# EAGLE design Si570 USB (EAGLE 7.7.0)
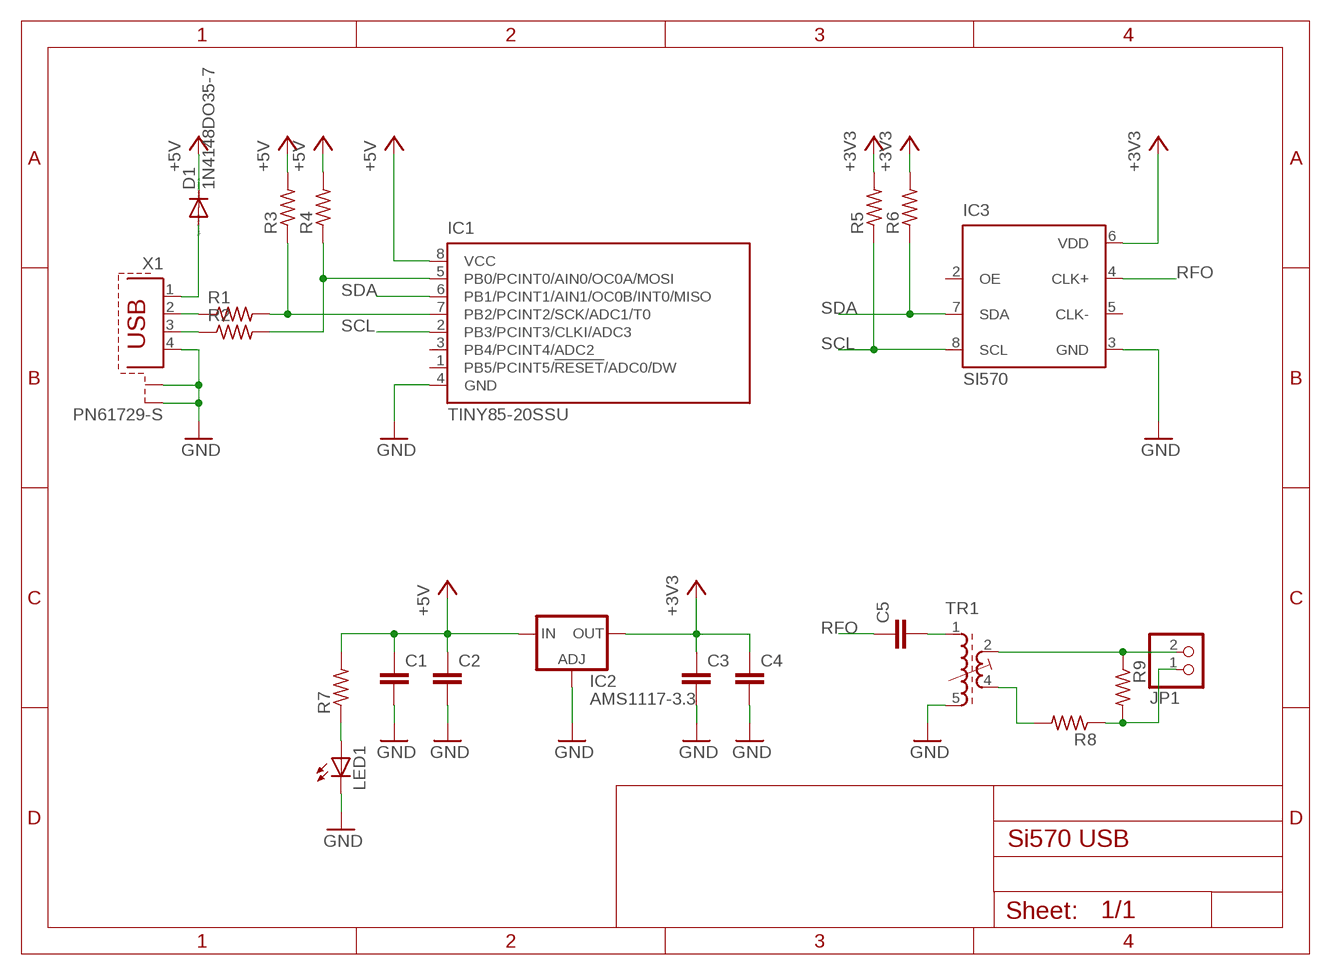
[diagram p0: schematic, sheet 1]

## Parts
C1  C-EUC1206K  [C1206K]
C2  C-EUC1206K  [C1206K]
C3  C-EUC1206K  [C1206K]
C4  C-EUC1206K  [C1206K]
C5  C-EUC1206K  [C1206K]
D1  1N4148DO35-7  [DO35-7]
IC1  TINY85-20SSU  TINY13-20SSU  [8S1]
IC2  AMS1117-3.3  LD117AS33TR  [SOT223]
IC3  SI570  [8-PIN]
JP1  PINHD-1X2  [1X02]
LED1  LED3MM  [LED3MM]
R1  R-US_R1206  [R1206]
R2  R-US_R1206  [R1206]
R3  R-US_R1206  [R1206]
R4  R-US_R1206  [R1206]
R5  R-US_R1206  [R1206]
R6  R-US_R1206  [R1206]
R7  R-US_R1206  [R1206]
R8  R-US_R1206  [R1206]
R9  R-US_R1206  [R1206]
TR1  71-4-1542  [71-5]
X1  PN61729-S  [PN61729-S]

## Nets
+3V3: C3.1 C4.1 IC2.4(OUT) IC3.6(VDD) R5.2 R6.2
+5V: C1.1 C2.1 D1.C IC1.8(VCC) IC2.3(IN) R3.2 R4.2 R7.2
GND: C1.2 C2.2 C3.2 C4.2 IC1.4(GND) IC2.1(ADJ) IC3.3(GND) LED1.K(C) TR1.5(E1) X1.4 X1.S1 X1.S2
N$1: R1.1 X1.2
N$2: R2.1 X1.3
N$3: D1.A X1.1
N$4: IC1.7(PB2/PCINT2/SCK/ADC1/T0) R1.2 R3.1
N$5: IC1.5(PB0/PCINT0/AIN0/OC0A/MOSI) R2.2 R4.1
N$6: C5.2 TR1.1(A1)
N$7: R8.2 TR1.4(E2)
N$8: JP1.2 R9.1 TR1.2(A2)
N$9: LED1.A R7.1
N$10: JP1.1 R8.1 R9.2
RFO: C5.1 IC3.4(CLK+)
SCL: IC1.2(PB3/PCINT3/CLKI/ADC3) IC3.8(SCL) R5.1
SDA: IC1.6(PB1/PCINT1/AIN1/OC0B/INT0/MISO) IC3.7(SDA) R6.1
Unconnected: IC1.1(PB5/PCINT5/!RESET!/ADC0/DW) IC1.3(PB4/PCINT4/ADC2) IC3.2(OE) IC3.5(CLK-) TR1.S1 TR1.S2

## Library data of the parts
C1-C5 = rcl:C-EU: CAPACITOR, European symbol
D1 = diode:1N4148: DIODE high speed (Philips)
IC1 = atmel:TINY13: 8-bit AVR Microcontroller with 1K Bytes In-System Programmable Flash Source: http://www.atmel.com/dyn/resources/prod_documents/2535S.pdf; MPN: ATTINY13-20SSU; OC_FARNELL: 1455133; OC_NEWARK: 58M3771
IC2 = v-reg:LD117A?*: Low drop fixed and adjustable positive voltage regulators 1 A Source: http://www.st.com/stonline/products/literature/ds/7194/ld1117axx.pdf
IC3 = silabs:SI570: ANY-RATE I2C PROGRAMMABLE XO/VCXO Source: si570.pdf; OC_FARNELL: unknown; OC_NEWARK: unknown
JP1 = pinhead:PINHD-1X2: PIN HEADER
LED1 = led:LED: LED OSRAM: - CHIPLED LG R971, LG N971, LY N971, LG Q971, LY Q971, LO R971, LY R971 LH N974, LH R974 LS Q976, LO Q976, LY Q976 LO Q996 - Hyper CHIPLED LW Q18S LB Q993, LB Q99A, LB R99A - SideLED LS A670, LO A670, LY A670, LG A670, LP A670 LB A673, LV A673, LT A673, LW A673 LH A674 LY A675 LS A676, LA A676, LO A676, LY A676, LW A676 LS A679, LY A679, LG A679 - Hyper Micro SIDELED® LS Y876, LA Y876, LO Y876, LY Y876 LT Y87S - SmartLED LW L88C, LW L88S LB L89C, LB L89S, LG L890 LS L89K, LO L89K, LY L89K LS L896, LA L896, LO L896, LY L896 - TOPLED LS T670, LO T670, LY T670, LG T670, LP T670 LSG T670, LSP T670, LSY T670, LOP T670, LYG T670 LG T671, LOG T671, LSG T671 LB T673, LV T673, LT T673, LW T673 LH T674 LS T676, LA T676, LO T676, LY T676, LB T676, LH T676, LSB T676, LW T676 LB T67C, LV T67C, LT T67C, LS T67K, LO T67K, LY T67K, LW E67C LS E67B, LA E67B, LO E67B, LY E67B, LB E67C, LV E67C, LT E67C LW T67C LS T679, LY T679, LG T679 LS T770, LO T770, LY T770, LG T770, LP T770 LB T773, LV T773, LT T773, LW T773 LH T774 LS E675, LA E675, LY E675, LS T675 LS T776, LA T776, LO T776, LY T776, LB T776 LHGB T686 LT T68C, LB T68C - Hyper Mini TOPLED® LB M676 - Mini TOPLED Santana® LG M470 LS M47K, LO M47K, LY M47K Source: http://www.osram.convergy.de LUXEON: - LUMILED® LXK2-PW12-R00, LXK2-PW12-S00, LXK2-PW14-U00, LXK2-PW14-V00 LXK2-PM12-R00, LXK2-PM12-S00, LXK2-PM14-U00 LXK2-PE12-Q00, LXK2-PE12-R00, LXK2-PE12-S00, LXK2-PE14-T00, LXK2-PE14-U00 LXK2-PB12-K00, LXK2-PB12-L00, LXK2-PB12-M00, LXK2-PB14-N00, LXK2-PB14-P00, LXK2-PB14-Q00 LXK2-PR12-L00, LXK2-PR12-M00, LXK2-PR14-Q00, LXK2-PR14-R00 LXK2-PD12-Q00, LXK2-PD12-R00, LXK2-PD12-S00 LXK2-PH12-R00, LXK2-PH12-S00 LXK2-PL12-P00, LXK2-PL12-Q00, LXK2-PL12-R00 Source: www.luxeon.com KINGBRIGHT: KA-3528ASYC Source: www.kingbright.com
R1-R9 = rcl:R-US_: RESISTOR, American symbol
TR1 = inductor-neosid:71-4-: TRANSFORMER adjustable filter transformer; OC_FARNELL: unknown; OC_NEWARK: unknown
X1 = con-berg:PN61729-S: BERG USB connector; OC_FARNELL: unknown; OC_NEWARK: unknown

## Board
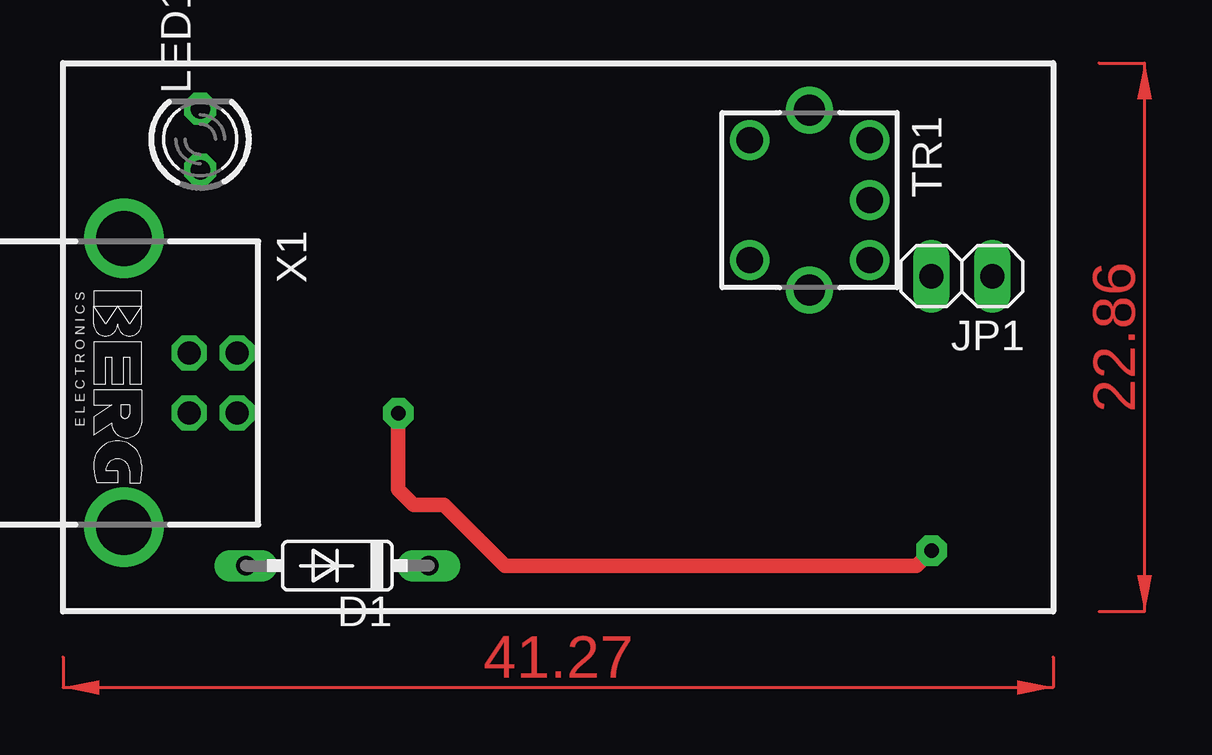
[diagram p1: board, top side]
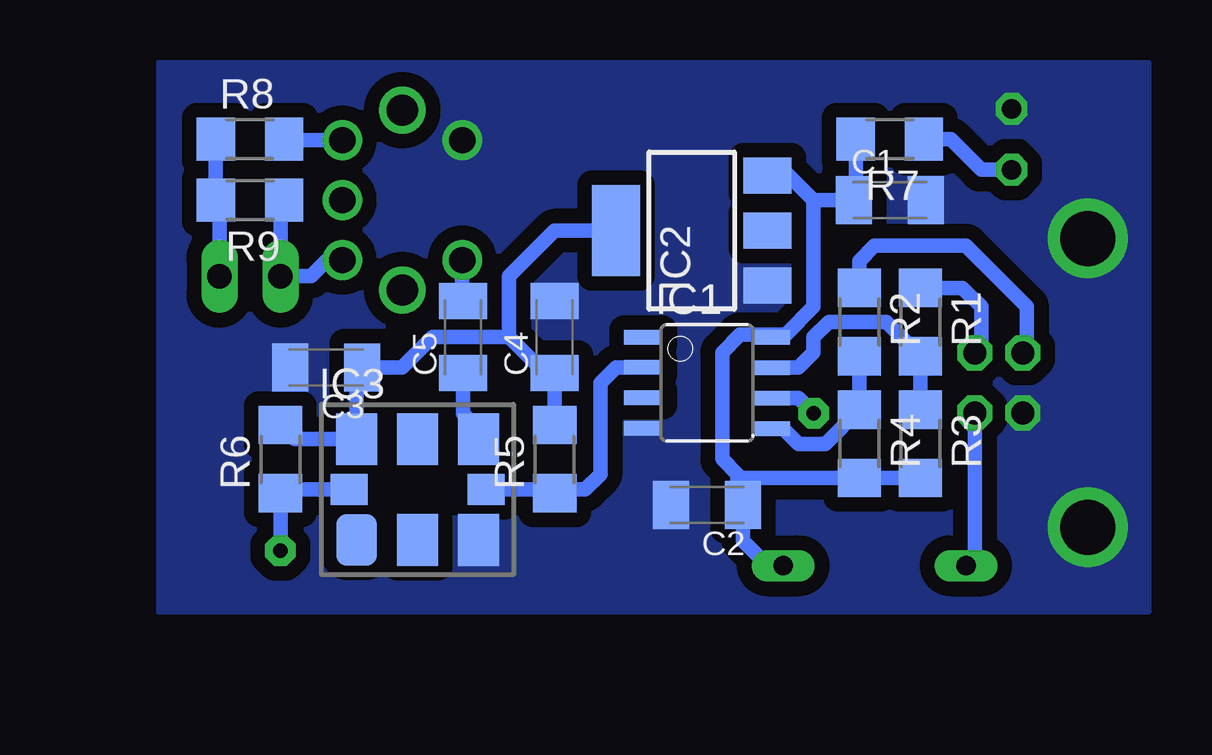
[diagram p2: board, bottom side, seen from below]

No outline drawn. Coordinates in mm, seen from the top.
Copper layers (1*16): Top 0.035mm / dielectric 1.5mm / Bottom 0.035mm
Design rules "default": minimum track width 10mil, minimum drill 24mil, track to track 8mil, track to pad 8mil, pad to pad 8mil, via to via 8mil, smd to smd 8mil, copper to edge 40mil, drill to drill 8mil, minimum pad ring 10mil, minimum via ring 8mil, stop-mask expansion 4mil, vias tented up to drill 0mil, thermal gap 10mil

### Footprints (pad centres in the part's own frame; a part is rotated, then mirrored left to right if it is on the bottom)
C1206K = smd 1.5 x 2: 1 -1.5,0; 2 1.5,0
DO35-7 = drill 0.813 long: A 3.81,0; C -3.81,0
8S1 = smd 0.6 x 1.6: 1 -1.905,-2.654; 2 -0.645,-2.654; 3 0.625,-2.654; 4 1.895,-2.654; 5 1.905,2.654; 6 0.635,2.654; 7 -0.635,2.654; 8 -1.905,2.654
SOT223 = smd 1.5 x 2: 1 -2.3,-3.15; 2 0,-3.15; 3 2.3,-3.15 | smd 3.8 x 2: 4 0,3.15
8-PIN = smd 1.7 x 2.15: 1 -2.54,-2.1; 2 0,-2.1; 3 2.54,-2.1; 4 2.54,2.1; 5 0,2.1; 6 -2.54,2.1 | smd 1.545 x 1.3: 7 -2.853,0; 8 2.853,0
1X02 = drill 1.016 long: 1 -1.27,0; 2 1.27,0
LED3MM = drill 0.813 octagon: A -1.27,0; K 1.27,0
R1206 = smd 1.6 x 1.803: 1 -1.422,0; 2 1.422,0
71-5 = drill 1.1: 1 2.5,-2.5; 2 2.5,2.5; 3 0,2.5; 4 -2.5,2.5; 5 -2.5,-2.5 | drill 1.3: S1 -3.75,0; S2 3.75,0
PN61729-S = drill 0.95 octagon: 1 1.25,4.71; 2 -1.25,4.71; 3 -1.25,2.71; 4 1.25,2.71 | drill 2.3 pad 2.9: S1 -6.02,0; S2 6.02,0

### Placement (x,y rotation side)
C1  10.79,17.14 0 bottom
C2  18.41,4.45 180 bottom
C3  34.29,10.16 180 bottom
C4  24.77,11.43 90 bottom
C5  28.57,11.43 90 bottom
D1  11.43,1.91 180 top
IC1  18.41,9.53 270 bottom
IC2  19.05,15.88 90 bottom
IC3  30.48,5.08 0 bottom
JP1  37.47,13.97 180 top
LED1  5.71,19.68 90 top
R1  9.53,12.06 270 bottom
R2  12.06,12.06 270 bottom
R3  9.53,6.99 270 bottom
R4  12.06,6.99 270 bottom
R5  24.77,6.35 90 bottom
R6  36.2,6.35 90 bottom
R7  10.79,19.68 180 bottom
R8  37.47,19.68 0 bottom
R9  37.47,17.14 180 bottom
TR1  31.11,17.14 270 top
X1  2.54,9.53 270 top

### Tracks (layer width: path | path; a pad name or v marks a point on that pad's centre or on a via)
+3V3
  Bottom 0.61: R6.2 35.6,7.18 IC3.6 33.02,9.93 C3.1 31.11,10.16 29.84,11.43 26.67,11.43 | 24.77,7.62 R5.2 C4.1 25.17,9.93 26.67,11.43 | IC2.4 24.77,15.88 26.67,13.97 26.67,11.43
+5V
  Bottom 0.61: R3.2 R4.2 16.99,5.56 17.14,5.71 | IC1.8 15.13,11.54 | 15.13,11.54 13.97,12.7 13.97,17.14 | 13.97,17.14 15.24,18.41 15.66,18.41 IC2.3 | 13.97,17.14 C1.1 12.22,17.22 R7.2 | 15.13,11.54 17.03,11.54 17.78,10.79 17.78,6.35 17.14,5.71 | 17.14,5.71 17.14,4.67 C2.1 16.91,2.94 15.88,1.91 D1.C
GND
  pour Bottom (isolate 0.61, no thermals): 0,22.86 41.27,22.86 41.27,0 0,0
N$1
  Bottom 0.61: R1.1 7.77,13.49 6.99,12.7 6.99,11.04 X1.2
N$2
  Bottom 0.61: R2.1 12.06,14.61 11.43,15.24 7.62,15.24 5.08,12.7 5.08,10.95 X1.3
N$3
  Bottom 0.61: X1.1 7.25,2.27 D1.A
N$4
  Bottom 0.61: R3.1 R1.2 10.95,12.06 13.34,12.06 13.97,11.43 13.97,10.79 14.61,10.16 IC1.7
N$5
  Bottom 0.61: R2.2 R4.1 13.49,6.99 14.61,6.99 15.24,7.62 IC1.5
N$6
  Bottom 0.61: TR1.1 28.61,12.97 C5.2
N$7
  Bottom 0.61: TR1.4 36,19.64 R8.2
N$8
  Bottom 0.61: R9.1 36.2,16.99 JP1.2 34.92,13.97 34.25,14.64 TR1.2
N$9
  Bottom 0.61: R7.1 8.26,19.68 6.99,18.41 LED1.A
N$10
  Bottom 0.61: R8.1 R9.2 38.73,16.99 JP1.1
RFO
  Bottom 0.61: C5.1 28.57,8.26 27.94,7.62 IC3.4
SCL
  Bottom 0.61: IC3.8 24.92,5.08 R5.1 24.61,5.08 23.5,5.08 22.86,5.71 22.86,9.53 22.21,10.17 IC1.2
SDA  (via drill 0.6 pad 1.27)
  Top 0.61: v13.97,8.26 13.97,5.08 14.61,4.45 15.88,4.45 18.41,1.91 35.56,1.91 v36.2,2.54
  Bottom 0.61: IC3.7 36.04,5.08 R6.1 v36.2,2.54 | IC1.6 14.61,8.89 v13.97,8.26
(copper drawn outside any net)
  shapes: Top area x2